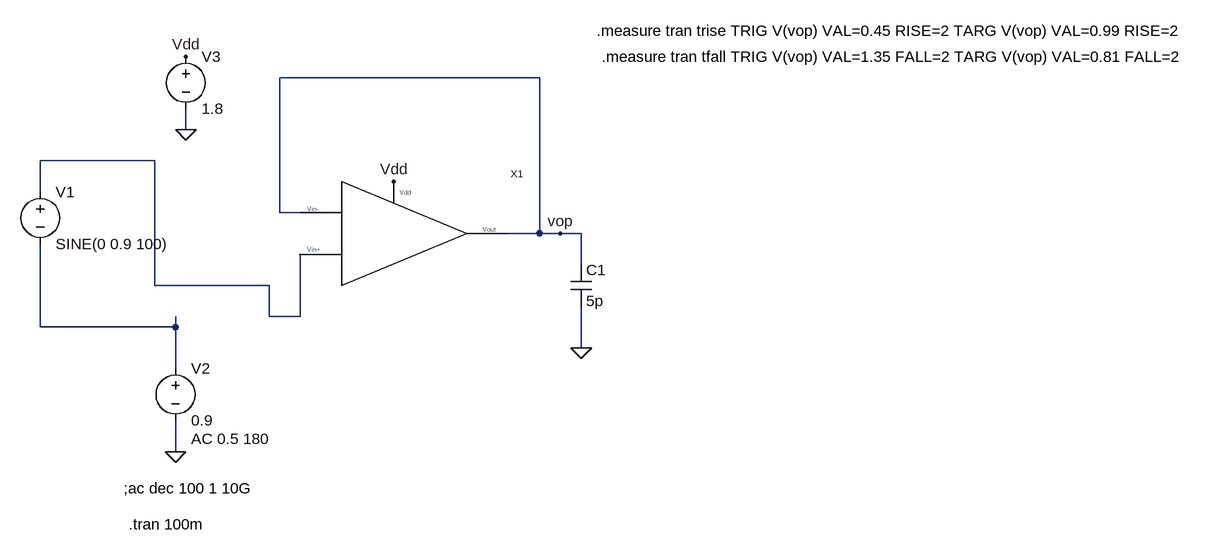
[diagram p0: schematic transient_analysis.asc]
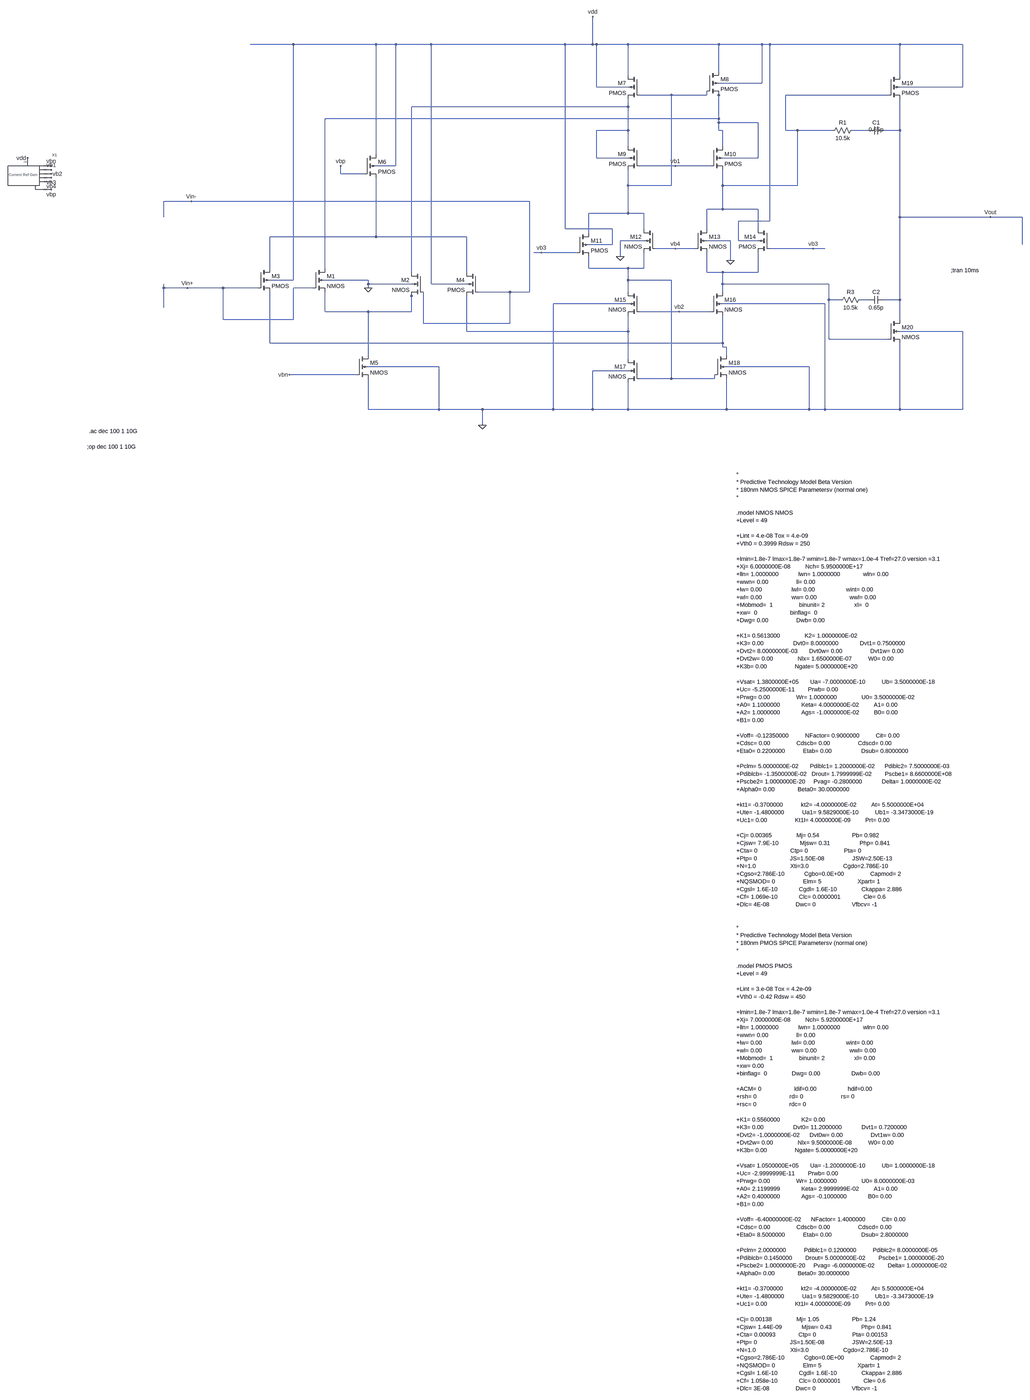
[diagram p1: sub-circuit rail_to_rail_opamp_withclassab_108.5db.asc, whole sheet]
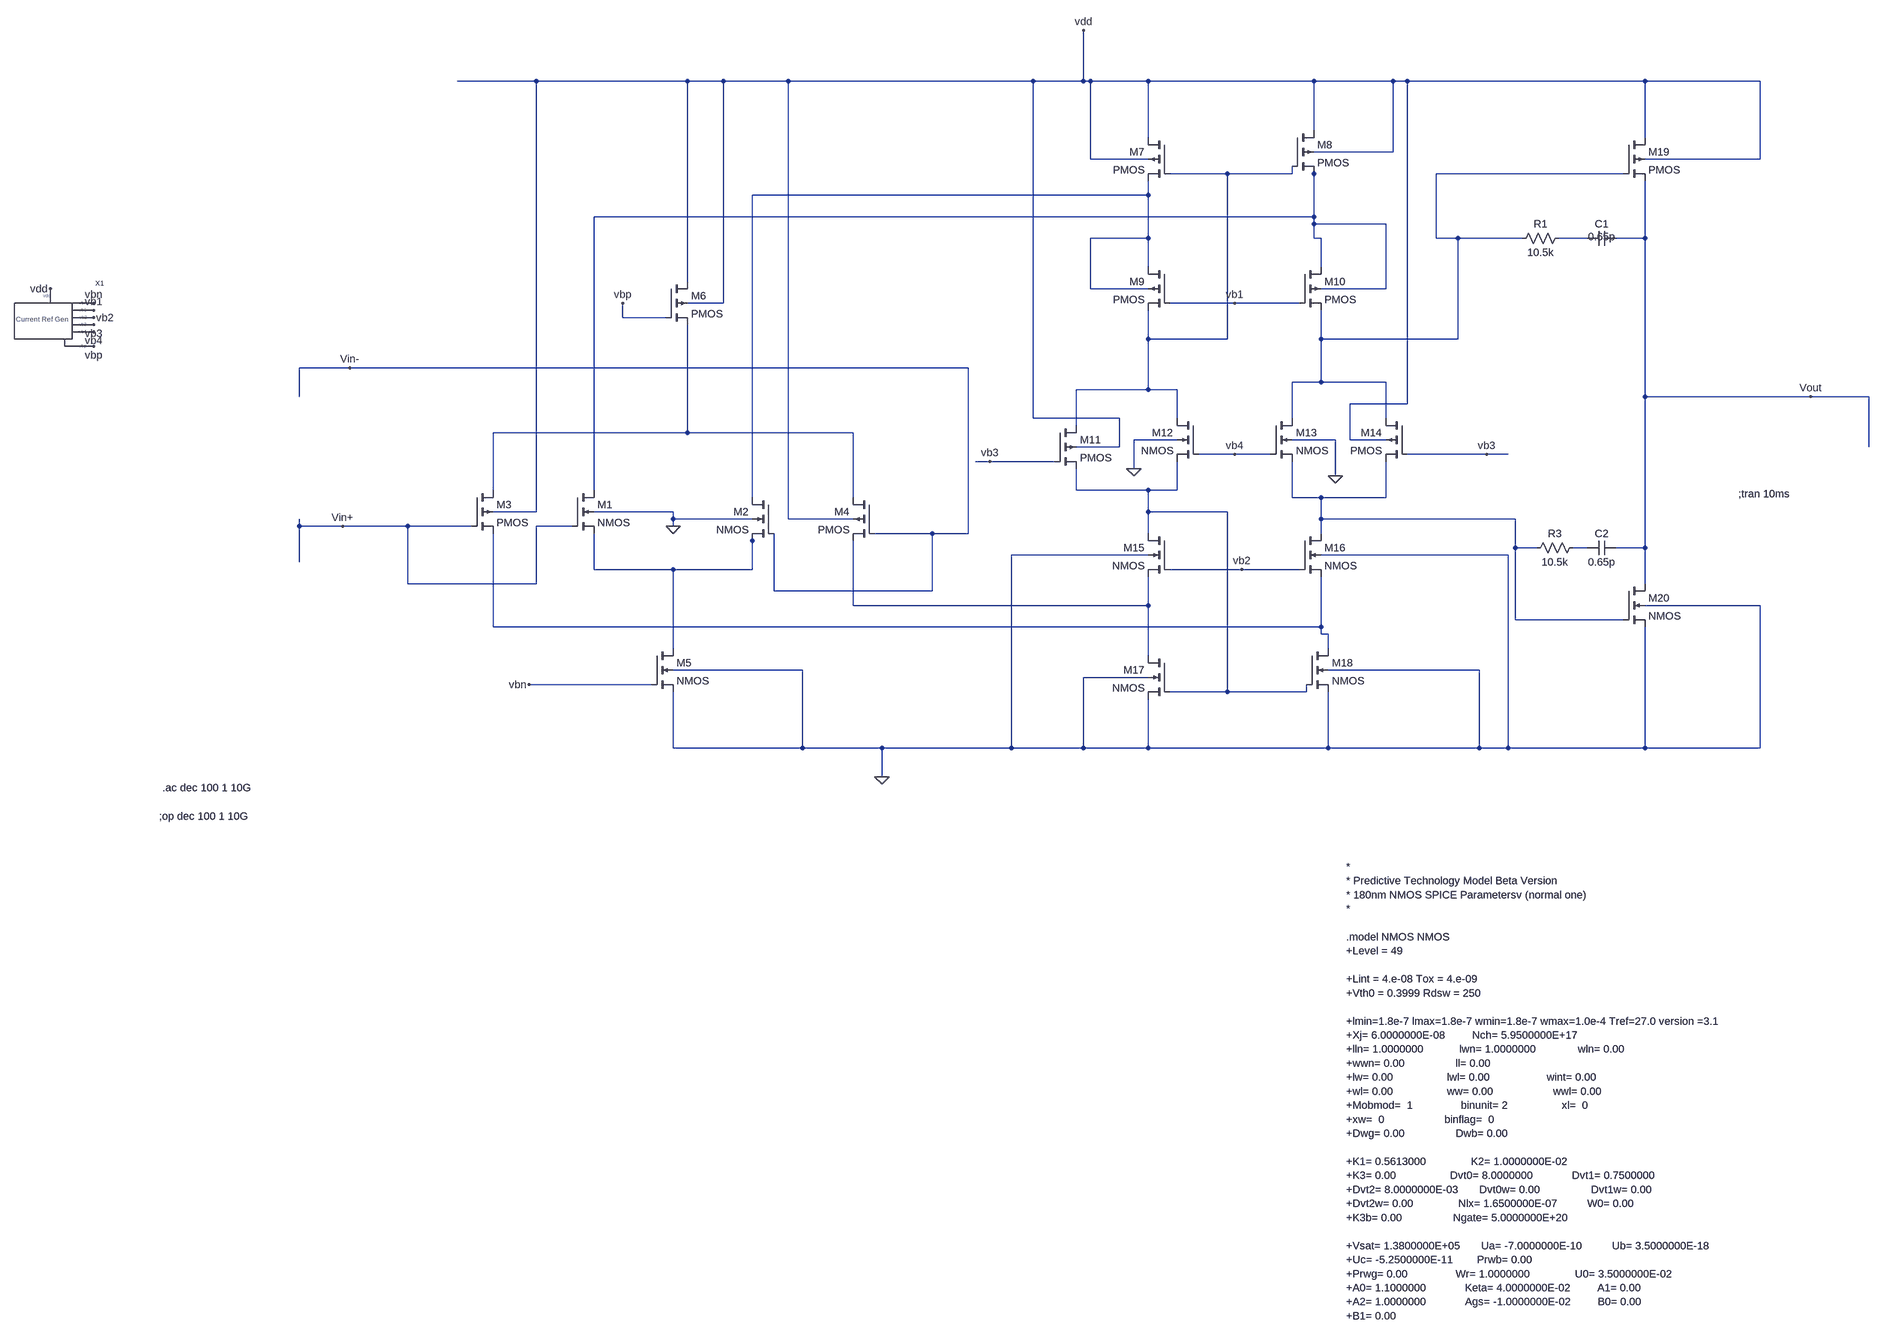
[diagram p2: sub-circuit rail_to_rail_opamp_withclassab_108.5db.asc, part, row 1 of 2, column 1 of 1]
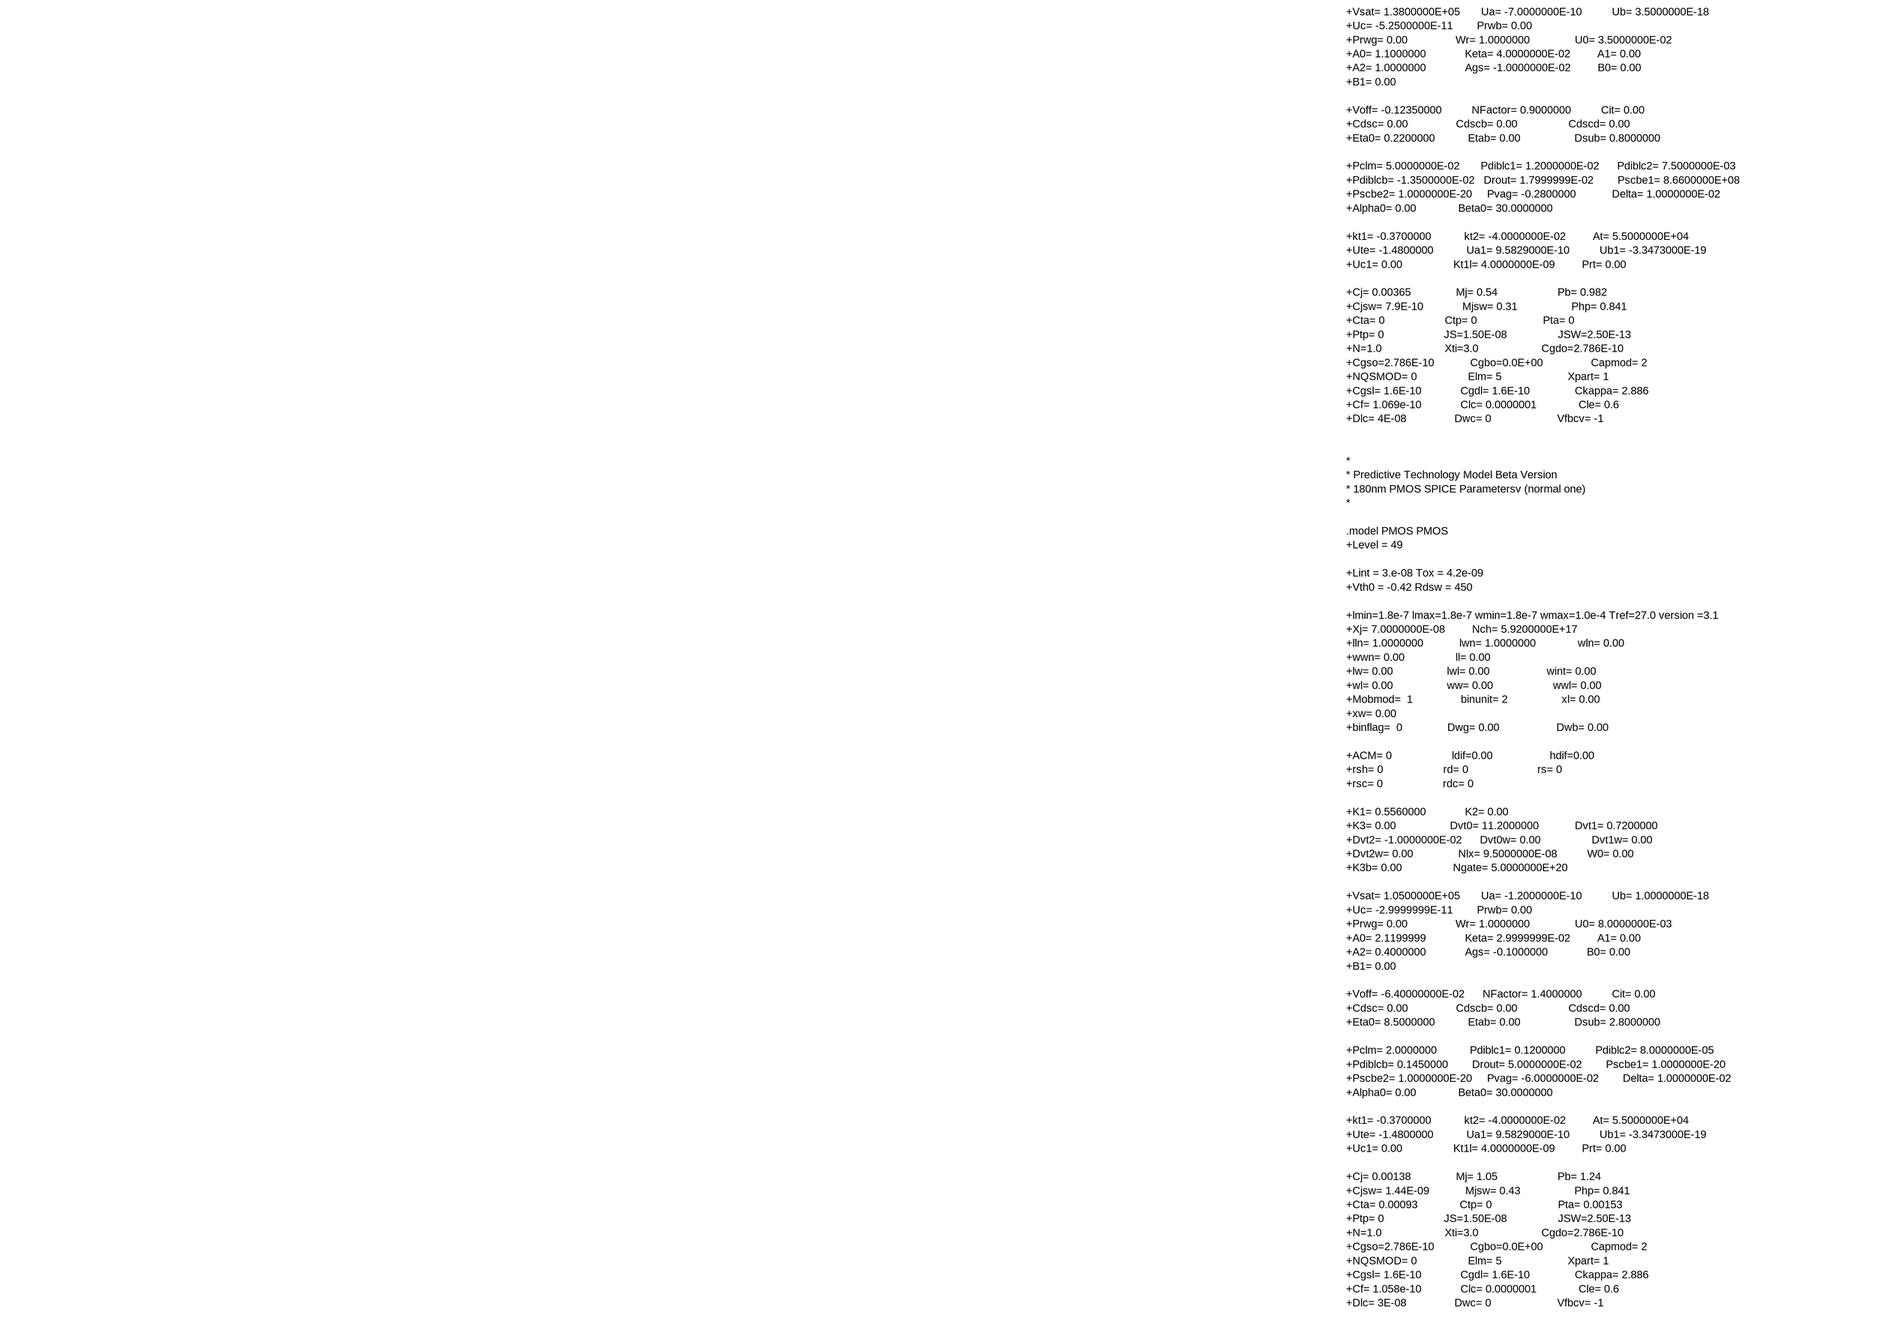
[diagram p3: sub-circuit rail_to_rail_opamp_withclassab_108.5db.asc, part, row 2 of 2, column 1 of 1]
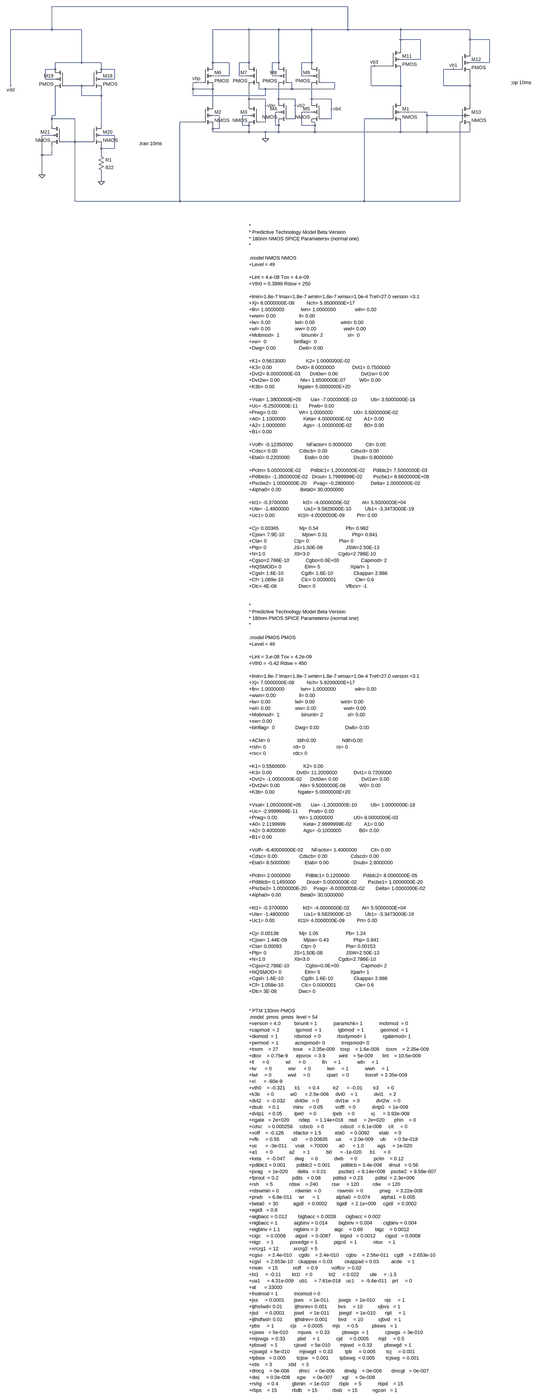
[diagram p4: sub-circuit curr_ref.asc, whole sheet]
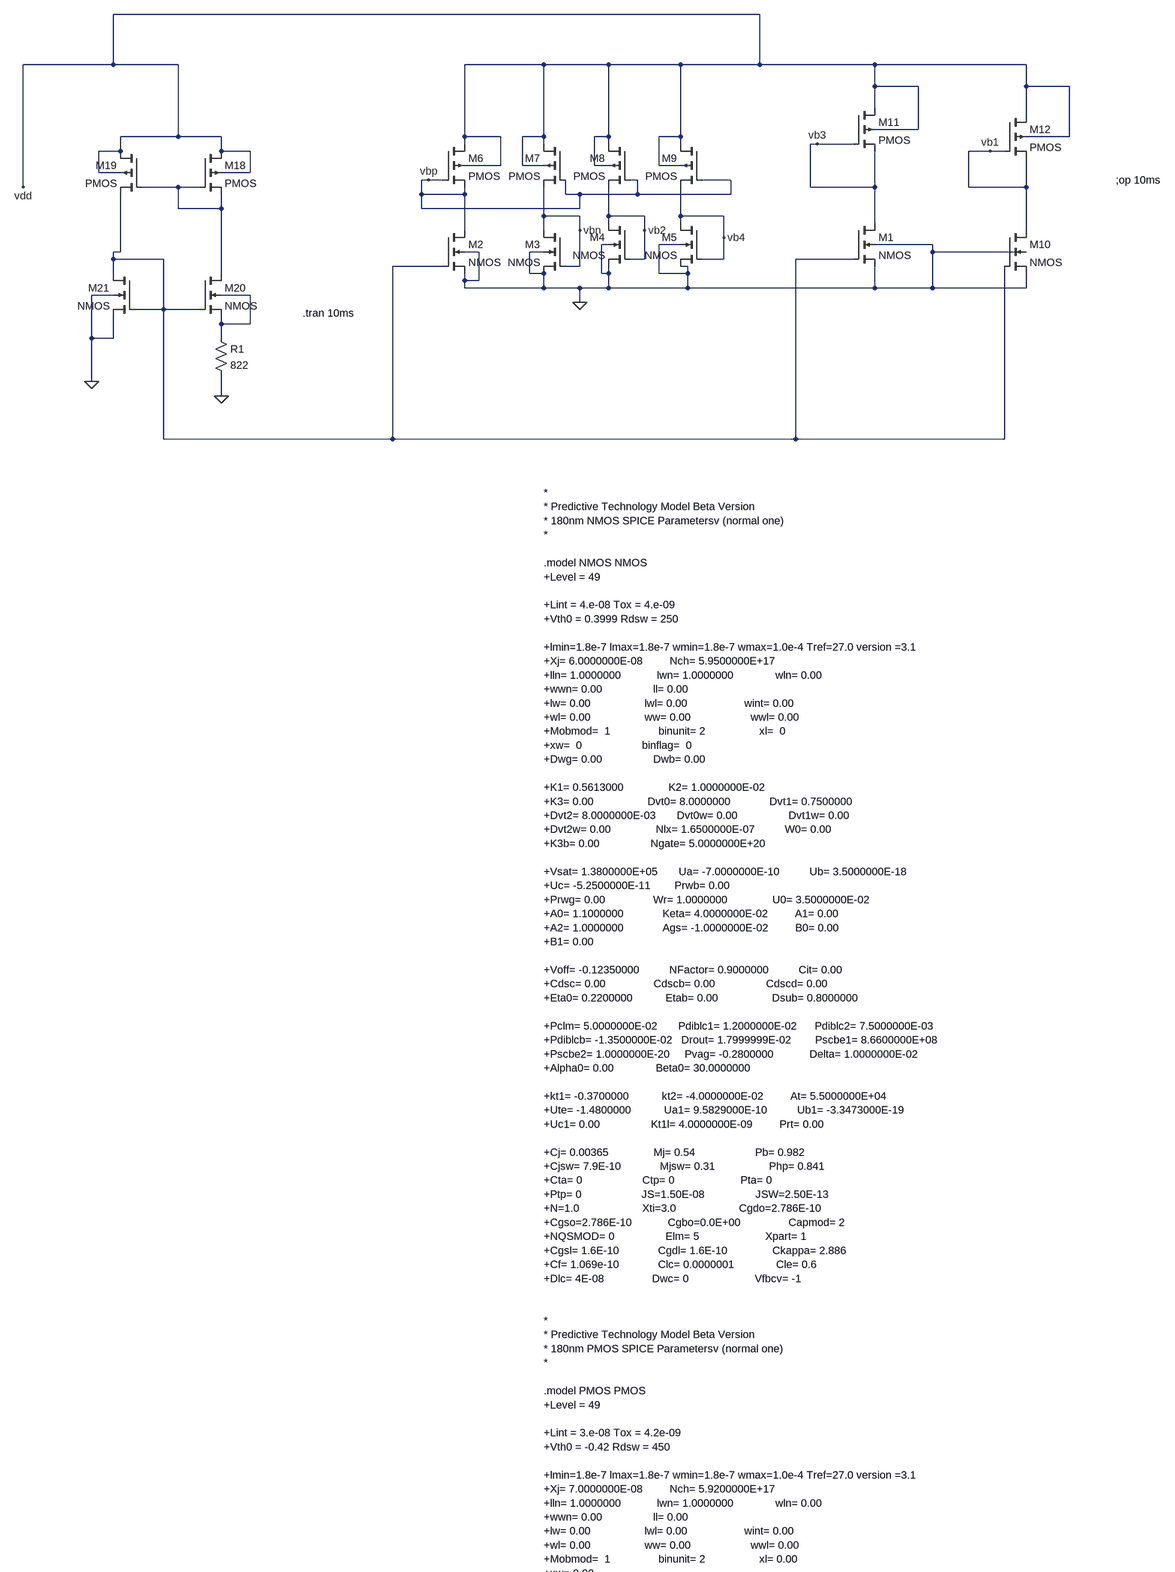
[diagram p5: sub-circuit curr_ref.asc, part, row 1 of 2, column 1 of 1]
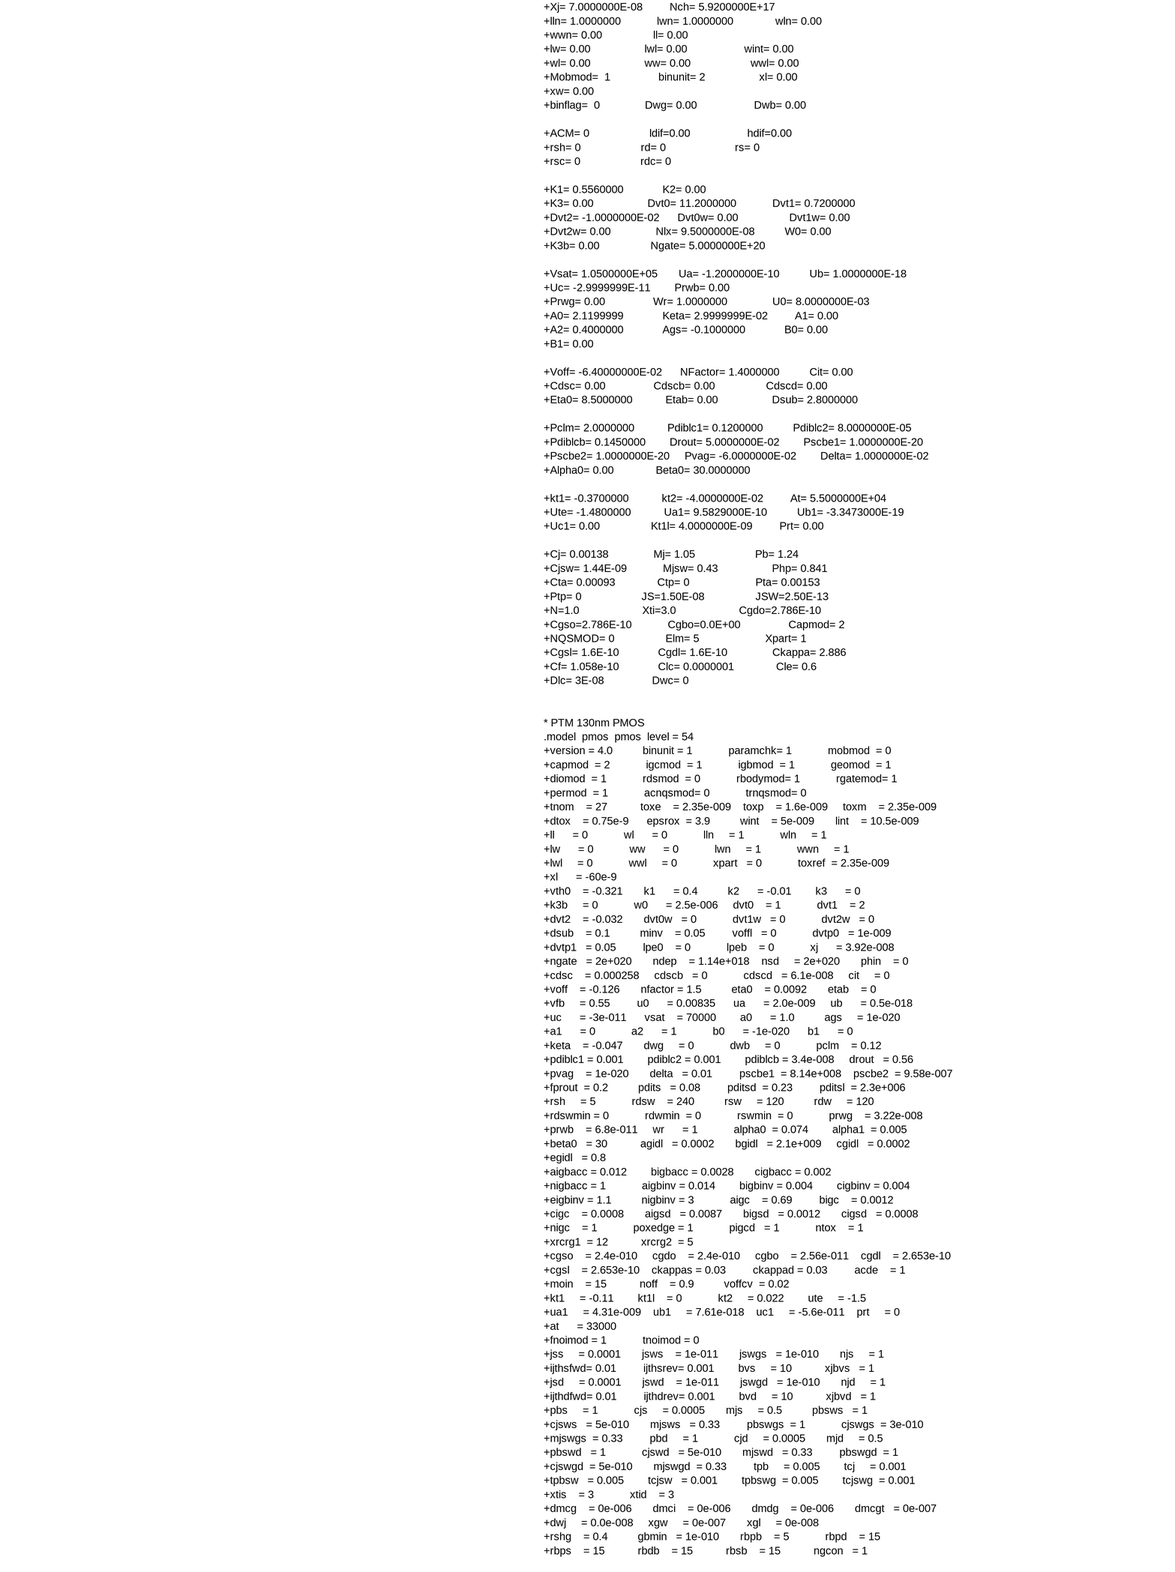
[diagram p6: sub-circuit curr_ref.asc, part, row 2 of 2, column 1 of 1]
transient_analysis.asc, the LTspice schematic file:
Version 4
SHEET 1 1500 680
WIRE 448 -64 48 -64
WIRE -96 16 -96 -16
WIRE -144 64 -320 64
WIRE -320 112 -320 64
WIRE 48 144 48 -64
WIRE 80 144 48 144
WIRE 448 176 448 -64
WIRE 448 176 400 176
WIRE 480 176 448 176
WIRE 512 176 480 176
WIRE 512 224 512 176
WIRE -144 256 -144 64
WIRE 32 256 -144 256
WIRE 32 304 32 256
WIRE 80 304 80 208
WIRE 80 304 32 304
WIRE -320 320 -320 192
WIRE -112 320 -112 304
WIRE -112 320 -320 320
WIRE 512 352 512 288
WIRE -112 384 -112 320
WIRE -112 512 -112 464
FLAG -96 16 0
FLAG -96 -96 Vdd
FLAG 224 96 Vdd
FLAG 512 352 0
FLAG -112 512 0
FLAG 480 176 vop
SYMBOL voltage -96 -112 R0
WINDOW 123 0 0 Left 0
WINDOW 39 0 0 Left 0
SYMATTR InstName V3
SYMATTR Value 1.8
SYMBOL cap 496 224 R0
SYMATTR InstName C1
SYMATTR Value 5p
SYMBOL voltage -112 368 R0
WINDOW 123 24 124 Left 2
WINDOW 39 0 0 Left 0
SYMATTR InstName V2
SYMATTR Value 0.9
SYMATTR Value2 AC 0.5 180
SYMBOL rail_to_rail_opamp_withclassAB_108.5db 224 176 R0
SYMATTR InstName X1
SYMBOL voltage -320 96 R0
WINDOW 123 0 0 Left 0
WINDOW 39 0 0 Left 0
SYMATTR InstName V1
SYMATTR Value SINE(0 0.9 100)
TEXT -192 568 Left 2 !;ac dec 100 1 10G
TEXT 536 -136 Left 2 !.measure tran trise TRIG V(vop) VAL=0.45 RISE=2 TARG V(vop) VAL=0.99 RISE=2
TEXT 544 -96 Left 2 !.measure tran tfall TRIG V(vop) VAL=1.35 FALL=2 TARG V(vop) VAL=0.81 FALL=2
TEXT -184 624 Left 2 !.tran 100m

The netlist it stands for:
* transient_analysis.asc
V3 Vdd 0 1.8
C1 vop 0 5p
V2 N002 0 0.9 AC 0.5 180
XX1 vop N001 vop Vdd rail_to_rail_opamp_withclassab_108.5db
V1 N001 N002 SINE(0 0.9 100)

* block symbol definitions
.subckt rail_to_rail_opamp_withclassab_108.5db Vin- Vin+ Vout Vdd
M1 N002 Vin+ N009 0 NMOS l=1u w=27u ad=9.72p as=9.72p pd=54.72u ps=54.72u
M2 N004 Vin- N009 0 NMOS l=1u w=27u ad=9.72p as=9.72p pd=54.72u ps=54.72u
M5 N009 vbn 0 0 NMOS l=1u w=20u ad=7.2p as=7.2p pd=40.72u ps=40.72u
M18 N012 N007 0 0 NMOS l=1u w=4.1u ad=1.476p as=1.476p pd=8.92u ps=8.92u
M16 N008 vb2 N012 0 NMOS l=1u w=3.5u ad=1.26p as=1.26p pd=7.72u ps=7.72u
M15 N007 vb2 N011 0 NMOS l=1u w=3.5u ad=1.26p as=1.26p pd=7.72u ps=7.72u
M17 N011 N007 0 0 NMOS l=1u w=4.1u ad=1.476p as=1.476p pd=8.92u ps=8.92u
M12 N001 vb4 N007 0 NMOS l=1u w=2u ad=0.72p as=0.72p pd=4.72u ps=4.72u
M13 N003 vb4 N008 0 NMOS l=1u w=2u ad=0.72p as=0.72p pd=4.72u ps=4.72u
M3 N006 Vin+ N012 vdd PMOS l=1u w=72.8u ad=26.2p as=26.2p pd=146.3u ps=146.3u
M4 N006 Vin- N011 vdd PMOS l=1u w=72.8u ad=26.2p as=26.2p pd=146.3u ps=146.3u
M6 vdd vbp N006 vdd PMOS l=1u w=110u ad=39.6p as=39.6p pd=220.72u ps=220.72u
M11 N001 vb3 N007 vdd PMOS l=1u w=9u ad=3.24p as=3.24p pd=18.72u ps=18.72u
M10 N002 vb1 N003 N002 PMOS l=1u w=15u ad=5.4p as=5.4p pd=30.72u ps=30.72u
M8 vdd N001 N002 vdd PMOS l=1u w=36u ad=12.96p as=12.96p pd=72.72u ps=72.72u
M7 vdd N001 N004 vdd PMOS l=1u w=36u ad=12.96p as=12.96p pd=72.72u ps=72.72
M9 N004 vb1 N001 N004 PMOS l=1u w=15u ad=5.4p as=5.4p pd=30.72u ps=30.72u
M14 N003 vb3 N008 vdd PMOS l=1u w=9u ad=3.24p as=3.24p pd=18.72u ps=18.72u
M19 vdd N003 Vout vdd PMOS l=0.25u w=65u ad=23p as=23p pd=130u ps=130u
M20 Vout N008 0 0 NMOS l=0.25u w=28.7u ad=9p as=9p pd=50u ps=50u
C1 Vout N005 0.65p
C2 Vout N010 0.65p
R1 N005 N003 10.5k
R3 N010 N008 10.5k
XX1 vdd vbn vb1 vb2 vb3 vb4 vbp curr_ref
.ac dec 100 1 10G
*
* Predictive Technology Model Beta Version
* 180nm NMOS SPICE Parametersv (normal one)
*
.model NMOS NMOS
+Level = 49
+Lint = 4.e-08 Tox = 4.e-09
+Vth0 = 0.3999 Rdsw = 250
+lmin=1.8e-7 lmax=1.8e-7 wmin=1.8e-7 wmax=1.0e-4 Tref=27.0 version =3.1
+Xj= 6.0000000E-08         Nch= 5.9500000E+17
+lln= 1.0000000            lwn= 1.0000000              wln= 0.00
+wwn= 0.00                 ll= 0.00
+lw= 0.00                  lwl= 0.00                   wint= 0.00
+wl= 0.00                  ww= 0.00                    wwl= 0.00
+Mobmod=  1                binunit= 2                  xl=  0
+xw=  0                    binflag=  0
+Dwg= 0.00                 Dwb= 0.00
+K1= 0.5613000               K2= 1.0000000E-02
+K3= 0.00                  Dvt0= 8.0000000             Dvt1= 0.7500000
+Dvt2= 8.0000000E-03       Dvt0w= 0.00                 Dvt1w= 0.00
+Dvt2w= 0.00               Nlx= 1.6500000E-07          W0= 0.00
+K3b= 0.00                 Ngate= 5.0000000E+20
+Vsat= 1.3800000E+05       Ua= -7.0000000E-10          Ub= 3.5000000E-18
+Uc= -5.2500000E-11        Prwb= 0.00
+Prwg= 0.00                Wr= 1.0000000               U0= 3.5000000E-02
+A0= 1.1000000             Keta= 4.0000000E-02         A1= 0.00
+A2= 1.0000000             Ags= -1.0000000E-02         B0= 0.00
+B1= 0.00
+Voff= -0.12350000          NFactor= 0.9000000          Cit= 0.00
+Cdsc= 0.00                Cdscb= 0.00                 Cdscd= 0.00
+Eta0= 0.2200000           Etab= 0.00                  Dsub= 0.8000000
+Pclm= 5.0000000E-02       Pdiblc1= 1.2000000E-02      Pdiblc2= 7.5000000E-03
+Pdiblcb= -1.3500000E-02   Drout= 1.7999999E-02        Pscbe1= 8.6600000E+08
+Pscbe2= 1.0000000E-20     Pvag= -0.2800000            Delta= 1.0000000E-02
+Alpha0= 0.00              Beta0= 30.0000000
+kt1= -0.3700000           kt2= -4.0000000E-02         At= 5.5000000E+04
+Ute= -1.4800000           Ua1= 9.5829000E-10          Ub1= -3.3473000E-19
+Uc1= 0.00                 Kt1l= 4.0000000E-09         Prt= 0.00
+Cj= 0.00365               Mj= 0.54                    Pb= 0.982
+Cjsw= 7.9E-10             Mjsw= 0.31                  Php= 0.841
+Cta= 0                    Ctp= 0                      Pta= 0
+Ptp= 0                    JS=1.50E-08                 JSW=2.50E-13
+N=1.0                     Xti=3.0                     Cgdo=2.786E-10
+Cgso=2.786E-10            Cgbo=0.0E+00                Capmod= 2
+NQSMOD= 0                 Elm= 5                      Xpart= 1
+Cgsl= 1.6E-10             Cgdl= 1.6E-10               Ckappa= 2.886
+Cf= 1.069e-10             Clc= 0.0000001              Cle= 0.6
+Dlc= 4E-08                Dwc= 0                      Vfbcv= -1
*
* Predictive Technology Model Beta Version
* 180nm PMOS SPICE Parametersv (normal one)
*
.model PMOS PMOS
+Level = 49
+Lint = 3.e-08 Tox = 4.2e-09
+Vth0 = -0.42 Rdsw = 450
+lmin=1.8e-7 lmax=1.8e-7 wmin=1.8e-7 wmax=1.0e-4 Tref=27.0 version =3.1
+Xj= 7.0000000E-08         Nch= 5.9200000E+17
+lln= 1.0000000            lwn= 1.0000000              wln= 0.00
+wwn= 0.00                 ll= 0.00
+lw= 0.00                  lwl= 0.00                   wint= 0.00
+wl= 0.00                  ww= 0.00                    wwl= 0.00
+Mobmod=  1                binunit= 2                  xl= 0.00
+xw= 0.00
+binflag=  0               Dwg= 0.00                   Dwb= 0.00
+ACM= 0                    ldif=0.00                   hdif=0.00
+rsh= 0                    rd= 0                       rs= 0
+rsc= 0                    rdc= 0
+K1= 0.5560000             K2= 0.00
+K3= 0.00                  Dvt0= 11.2000000            Dvt1= 0.7200000
+Dvt2= -1.0000000E-02      Dvt0w= 0.00                 Dvt1w= 0.00
+Dvt2w= 0.00               Nlx= 9.5000000E-08          W0= 0.00
+K3b= 0.00                 Ngate= 5.0000000E+20
+Vsat= 1.0500000E+05       Ua= -1.2000000E-10          Ub= 1.0000000E-18
+Uc= -2.9999999E-11        Prwb= 0.00
+Prwg= 0.00                Wr= 1.0000000               U0= 8.0000000E-03
+A0= 2.1199999             Keta= 2.9999999E-02         A1= 0.00
+A2= 0.4000000             Ags= -0.1000000             B0= 0.00
+B1= 0.00
+Voff= -6.40000000E-02      NFactor= 1.4000000          Cit= 0.00
+Cdsc= 0.00                Cdscb= 0.00                 Cdscd= 0.00
+Eta0= 8.5000000           Etab= 0.00                  Dsub= 2.8000000
+Pclm= 2.0000000           Pdiblc1= 0.1200000          Pdiblc2= 8.0000000E-05
+Pdiblcb= 0.1450000        Drout= 5.0000000E-02        Pscbe1= 1.0000000E-20
+Pscbe2= 1.0000000E-20     Pvag= -6.0000000E-02        Delta= 1.0000000E-02
+Alpha0= 0.00              Beta0= 30.0000000
+kt1= -0.3700000           kt2= -4.0000000E-02         At= 5.5000000E+04
+Ute= -1.4800000           Ua1= 9.5829000E-10          Ub1= -3.3473000E-19
+Uc1= 0.00                 Kt1l= 4.0000000E-09         Prt= 0.00
+Cj= 0.00138               Mj= 1.05                    Pb= 1.24
+Cjsw= 1.44E-09            Mjsw= 0.43                  Php= 0.841
+Cta= 0.00093              Ctp= 0                      Pta= 0.00153
+Ptp= 0                    JS=1.50E-08                 JSW=2.50E-13
+N=1.0                     Xti=3.0                     Cgdo=2.786E-10
+Cgso=2.786E-10            Cgbo=0.0E+00                Capmod= 2
+NQSMOD= 0                 Elm= 5                      Xpart= 1
+Cgsl= 1.6E-10             Cgdl= 1.6E-10               Ckappa= 2.886
+Cf= 1.058e-10             Clc= 0.0000001              Cle= 0.6
+Dlc= 3E-08                Dwc= 0                      Vfbcv= -1
;op dec 100 1 10G
;tran 10ms
.ends rail_to_rail_opamp_withclassab_108.5db

.subckt curr_ref vdd vbn vb1 vb2 vb3 vb4 vbp
M2 vbp N002 0 0 NMOS l=1u w=37.3u
M3 vbn vbn 0 0 NMOS l=1u w=55.5u
M4 vb2 vb2 0 0 NMOS l=1u w=23.4u
M5 vb4 vb4 0 0 NMOS l=1u w=5u
M6 vdd vbp vbp vdd PMOS l=1u w=2u
M7 vdd vbp vbn vdd PMOS l=1u w=50u
M8 vdd vbp vb2 vdd PMOS l=1u w=120u
M9 vdd vbp vb4 vdd PMOS l=1u w=91.8u
M18 vdd N001 N001 vdd PMOS l=1u w=400u
M19 vdd N001 N002 vdd PMOS l=1u w=400u
M20 N001 N002 N003 N003 NMOS l=1u w=850u
M21 N002 N002 0 0 NMOS l=1u w=400u
R1 N003 0 822
M1 vb3 N002 0 0 NMOS l=1u w=400u
M10 vb1 N002 0 0 NMOS l=1u w=400u
M11 vdd vb3 vb3 vdd PMOS l=1u w=2.32u
M12 vdd vb1 vb1 vdd PMOS l=1u w=10u
.tran 10ms
*
* Predictive Technology Model Beta Version
* 180nm NMOS SPICE Parametersv (normal one)
*
.model NMOS NMOS
+Level = 49
+Lint = 4.e-08 Tox = 4.e-09
+Vth0 = 0.3999 Rdsw = 250
+lmin=1.8e-7 lmax=1.8e-7 wmin=1.8e-7 wmax=1.0e-4 Tref=27.0 version =3.1
+Xj= 6.0000000E-08         Nch= 5.9500000E+17
+lln= 1.0000000            lwn= 1.0000000              wln= 0.00
+wwn= 0.00                 ll= 0.00
+lw= 0.00                  lwl= 0.00                   wint= 0.00
+wl= 0.00                  ww= 0.00                    wwl= 0.00
+Mobmod=  1                binunit= 2                  xl=  0
+xw=  0                    binflag=  0
+Dwg= 0.00                 Dwb= 0.00
+K1= 0.5613000               K2= 1.0000000E-02
+K3= 0.00                  Dvt0= 8.0000000             Dvt1= 0.7500000
+Dvt2= 8.0000000E-03       Dvt0w= 0.00                 Dvt1w= 0.00
+Dvt2w= 0.00               Nlx= 1.6500000E-07          W0= 0.00
+K3b= 0.00                 Ngate= 5.0000000E+20
+Vsat= 1.3800000E+05       Ua= -7.0000000E-10          Ub= 3.5000000E-18
+Uc= -5.2500000E-11        Prwb= 0.00
+Prwg= 0.00                Wr= 1.0000000               U0= 3.5000000E-02
+A0= 1.1000000             Keta= 4.0000000E-02         A1= 0.00
+A2= 1.0000000             Ags= -1.0000000E-02         B0= 0.00
+B1= 0.00
+Voff= -0.12350000          NFactor= 0.9000000          Cit= 0.00
+Cdsc= 0.00                Cdscb= 0.00                 Cdscd= 0.00
+Eta0= 0.2200000           Etab= 0.00                  Dsub= 0.8000000
+Pclm= 5.0000000E-02       Pdiblc1= 1.2000000E-02      Pdiblc2= 7.5000000E-03
+Pdiblcb= -1.3500000E-02   Drout= 1.7999999E-02        Pscbe1= 8.6600000E+08
+Pscbe2= 1.0000000E-20     Pvag= -0.2800000            Delta= 1.0000000E-02
+Alpha0= 0.00              Beta0= 30.0000000
+kt1= -0.3700000           kt2= -4.0000000E-02         At= 5.5000000E+04
+Ute= -1.4800000           Ua1= 9.5829000E-10          Ub1= -3.3473000E-19
+Uc1= 0.00                 Kt1l= 4.0000000E-09         Prt= 0.00
+Cj= 0.00365               Mj= 0.54                    Pb= 0.982
+Cjsw= 7.9E-10             Mjsw= 0.31                  Php= 0.841
+Cta= 0                    Ctp= 0                      Pta= 0
+Ptp= 0                    JS=1.50E-08                 JSW=2.50E-13
+N=1.0                     Xti=3.0                     Cgdo=2.786E-10
+Cgso=2.786E-10            Cgbo=0.0E+00                Capmod= 2
+NQSMOD= 0                 Elm= 5                      Xpart= 1
+Cgsl= 1.6E-10             Cgdl= 1.6E-10               Ckappa= 2.886
+Cf= 1.069e-10             Clc= 0.0000001              Cle= 0.6
+Dlc= 4E-08                Dwc= 0                      Vfbcv= -1
*
* Predictive Technology Model Beta Version
* 180nm PMOS SPICE Parametersv (normal one)
*
.model PMOS PMOS
+Level = 49
+Lint = 3.e-08 Tox = 4.2e-09
+Vth0 = -0.42 Rdsw = 450
+lmin=1.8e-7 lmax=1.8e-7 wmin=1.8e-7 wmax=1.0e-4 Tref=27.0 version =3.1
+Xj= 7.0000000E-08         Nch= 5.9200000E+17
+lln= 1.0000000            lwn= 1.0000000              wln= 0.00
+wwn= 0.00                 ll= 0.00
+lw= 0.00                  lwl= 0.00                   wint= 0.00
+wl= 0.00                  ww= 0.00                    wwl= 0.00
+Mobmod=  1                binunit= 2                  xl= 0.00
+xw= 0.00
+binflag=  0               Dwg= 0.00                   Dwb= 0.00
+ACM= 0                    ldif=0.00                   hdif=0.00
+rsh= 0                    rd= 0                       rs= 0
+rsc= 0                    rdc= 0
+K1= 0.5560000             K2= 0.00
+K3= 0.00                  Dvt0= 11.2000000            Dvt1= 0.7200000
+Dvt2= -1.0000000E-02      Dvt0w= 0.00                 Dvt1w= 0.00
+Dvt2w= 0.00               Nlx= 9.5000000E-08          W0= 0.00
+K3b= 0.00                 Ngate= 5.0000000E+20
+Vsat= 1.0500000E+05       Ua= -1.2000000E-10          Ub= 1.0000000E-18
+Uc= -2.9999999E-11        Prwb= 0.00
+Prwg= 0.00                Wr= 1.0000000               U0= 8.0000000E-03
+A0= 2.1199999             Keta= 2.9999999E-02         A1= 0.00
+A2= 0.4000000             Ags= -0.1000000             B0= 0.00
+B1= 0.00
+Voff= -6.40000000E-02      NFactor= 1.4000000          Cit= 0.00
+Cdsc= 0.00                Cdscb= 0.00                 Cdscd= 0.00
+Eta0= 8.5000000           Etab= 0.00                  Dsub= 2.8000000
+Pclm= 2.0000000           Pdiblc1= 0.1200000          Pdiblc2= 8.0000000E-05
+Pdiblcb= 0.1450000        Drout= 5.0000000E-02        Pscbe1= 1.0000000E-20
+Pscbe2= 1.0000000E-20     Pvag= -6.0000000E-02        Delta= 1.0000000E-02
+Alpha0= 0.00              Beta0= 30.0000000
+kt1= -0.3700000           kt2= -4.0000000E-02         At= 5.5000000E+04
+Ute= -1.4800000           Ua1= 9.5829000E-10          Ub1= -3.3473000E-19
+Uc1= 0.00                 Kt1l= 4.0000000E-09         Prt= 0.00
+Cj= 0.00138               Mj= 1.05                    Pb= 1.24
+Cjsw= 1.44E-09            Mjsw= 0.43                  Php= 0.841
+Cta= 0.00093              Ctp= 0                      Pta= 0.00153
+Ptp= 0                    JS=1.50E-08                 JSW=2.50E-13
+N=1.0                     Xti=3.0                     Cgdo=2.786E-10
+Cgso=2.786E-10            Cgbo=0.0E+00                Capmod= 2
+NQSMOD= 0                 Elm= 5                      Xpart= 1
+Cgsl= 1.6E-10             Cgdl= 1.6E-10               Ckappa= 2.886
+Cf= 1.058e-10             Clc= 0.0000001              Cle= 0.6
+Dlc= 3E-08                Dwc= 0
* PTM 130nm PMOS
.model  pmos  pmos  level = 54
+version = 4.0          binunit = 1            paramchk= 1            mobmod  = 0
+capmod  = 2            igcmod  = 1            igbmod  = 1            geomod  = 1
+diomod  = 1            rdsmod  = 0            rbodymod= 1            rgatemod= 1
+permod  = 1            acnqsmod= 0            trnqsmod= 0
+tnom    = 27           toxe    = 2.35e-009    toxp    = 1.6e-009     toxm    = 2.35e-009
+dtox    = 0.75e-9      epsrox  = 3.9          wint    = 5e-009       lint    = 10.5e-009
+ll      = 0            wl      = 0            lln     = 1            wln     = 1
+lw      = 0            ww      = 0            lwn     = 1            wwn     = 1
+lwl     = 0            wwl     = 0            xpart   = 0            toxref  = 2.35e-009
+xl      = -60e-9
+vth0    = -0.321       k1      = 0.4          k2      = -0.01        k3      = 0
+k3b     = 0            w0      = 2.5e-006     dvt0    = 1            dvt1    = 2
+dvt2    = -0.032       dvt0w   = 0            dvt1w   = 0            dvt2w   = 0
+dsub    = 0.1          minv    = 0.05         voffl   = 0            dvtp0   = 1e-009
+dvtp1   = 0.05         lpe0    = 0            lpeb    = 0            xj      = 3.92e-008
+ngate   = 2e+020       ndep    = 1.14e+018    nsd     = 2e+020       phin    = 0
+cdsc    = 0.000258     cdscb   = 0            cdscd   = 6.1e-008     cit     = 0
+voff    = -0.126       nfactor = 1.5          eta0    = 0.0092       etab    = 0
+vfb     = 0.55         u0      = 0.00835      ua      = 2.0e-009     ub      = 0.5e-018
+uc      = -3e-011      vsat    = 70000        a0      = 1.0          ags     = 1e-020
+a1      = 0            a2      = 1            b0      = -1e-020      b1      = 0
+keta    = -0.047       dwg     = 0            dwb     = 0            pclm    = 0.12
+pdiblc1 = 0.001        pdiblc2 = 0.001        pdiblcb = 3.4e-008     drout   = 0.56
+pvag    = 1e-020       delta   = 0.01         pscbe1  = 8.14e+008    pscbe2  = 9.58e-007
+fprout  = 0.2          pdits   = 0.08         pditsd  = 0.23         pditsl  = 2.3e+006
+rsh     = 5            rdsw    = 240          rsw     = 120          rdw     = 120
+rdswmin = 0            rdwmin  = 0            rswmin  = 0            prwg    = 3.22e-008
+prwb    = 6.8e-011     wr      = 1            alpha0  = 0.074        alpha1  = 0.005
+beta0   = 30           agidl   = 0.0002       bgidl   = 2.1e+009     cgidl   = 0.0002
+egidl   = 0.8
+aigbacc = 0.012        bigbacc = 0.0028       cigbacc = 0.002
+nigbacc = 1            aigbinv = 0.014        bigbinv = 0.004        cigbinv = 0.004
+eigbinv = 1.1          nigbinv = 3            aigc    = 0.69         bigc    = 0.0012
+cigc    = 0.0008       aigsd   = 0.0087       bigsd   = 0.0012       cigsd   = 0.0008
+nigc    = 1            poxedge = 1            pigcd   = 1            ntox    = 1
+xrcrg1  = 12           xrcrg2  = 5
+cgso    = 2.4e-010     cgdo    = 2.4e-010     cgbo    = 2.56e-011    cgdl    = 2.653e-10
+cgsl    = 2.653e-10    ckappas = 0.03         ckappad = 0.03         acde    = 1
+moin    = 15           noff    = 0.9          voffcv  = 0.02
+kt1     = -0.11        kt1l    = 0            kt2     = 0.022        ute     = -1.5
+ua1     = 4.31e-009    ub1     = 7.61e-018    uc1     = -5.6e-011    prt     = 0
+at      = 33000
+fnoimod = 1            tnoimod = 0
+jss     = 0.0001       jsws    = 1e-011       jswgs   = 1e-010       njs     = 1
+ijthsfwd= 0.01         ijthsrev= 0.001        bvs     = 10           xjbvs   = 1
+jsd     = 0.0001       jswd    = 1e-011       jswgd   = 1e-010       njd     = 1
+ijthdfwd= 0.01         ijthdrev= 0.001        bvd     = 10           xjbvd   = 1
+pbs     = 1            cjs     = 0.0005       mjs     = 0.5          pbsws   = 1
+cjsws   = 5e-010       mjsws   = 0.33         pbswgs  = 1            cjswgs  = 3e-010
+mjswgs  = 0.33         pbd     = 1            cjd     = 0.0005       mjd     = 0.5
+pbswd   = 1            cjswd   = 5e-010       mjswd   = 0.33         pbswgd  = 1
+cjswgd  = 5e-010       mjswgd  = 0.33         tpb     = 0.005        tcj     = 0.001
+tpbsw   = 0.005        tcjsw   = 0.001        tpbswg  = 0.005        tcjswg  = 0.001
+xtis    = 3            xtid    = 3
+dmcg    = 0e-006       dmci    = 0e-006       dmdg    = 0e-006       dmcgt   = 0e-007
+dwj     = 0.0e-008     xgw     = 0e-007       xgl     = 0e-008
+rshg    = 0.4          gbmin   = 1e-010       rbpb    = 5            rbpd    = 15
+rbps    = 15           rbdb    = 15           rbsb    = 15           ngcon   = 1
;op 10ms
.ends curr_ref

.model NMOS NMOS
.model PMOS PMOS
.lib standard.mos
;ac dec 100 1 10G
.measure tran trise TRIG V(vop) VAL=0.45 RISE=2 TARG V(vop) VAL=0.99 RISE=2
.measure tran tfall TRIG V(vop) VAL=1.35 FALL=2 TARG V(vop) VAL=0.81 FALL=2
.tran 100m
.backanno
.end